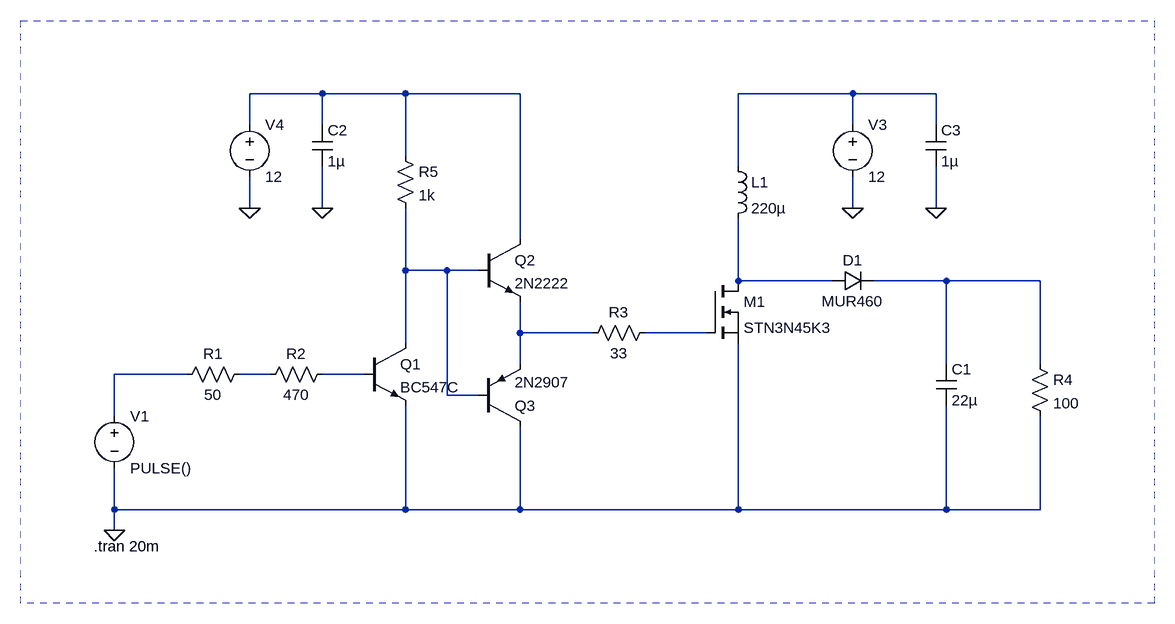
[diagram p0: schematic boost1.asc]
boost1.asc, the LTspice schematic file:
Version 4
SHEET 1 1556 680
WIRE 272 -128 160 -128
WIRE 400 -128 272 -128
WIRE 576 -128 400 -128
WIRE 1088 -128 912 -128
WIRE 1216 -128 1088 -128
WIRE 160 -80 160 -128
WIRE 272 -80 272 -128
WIRE 1088 -80 1088 -128
WIRE 1216 -80 1216 -128
WIRE 400 -32 400 -128
WIRE 912 -16 912 -128
WIRE 160 48 160 0
WIRE 272 48 272 -16
WIRE 1088 48 1088 0
WIRE 1216 48 1216 -16
WIRE 576 96 576 -128
WIRE 400 144 400 48
WIRE 464 144 400 144
WIRE 512 144 464 144
WIRE 912 160 912 64
WIRE 1056 160 912 160
WIRE 1232 160 1120 160
WIRE 1376 160 1232 160
WIRE 576 240 576 192
WIRE 688 240 576 240
WIRE 864 240 768 240
WIRE 400 256 400 144
WIRE 576 288 576 240
WIRE 1232 288 1232 160
WIRE 1376 288 1376 160
WIRE 64 304 -48 304
WIRE 192 304 144 304
WIRE 336 304 272 304
WIRE 464 336 464 144
WIRE 512 336 464 336
WIRE -48 368 -48 304
WIRE -48 512 -48 448
WIRE 400 512 400 352
WIRE 400 512 -48 512
WIRE 576 512 576 384
WIRE 576 512 400 512
WIRE 912 512 912 256
WIRE 912 512 576 512
WIRE 1232 512 1232 352
WIRE 1232 512 912 512
WIRE 1376 512 1376 368
WIRE 1376 512 1232 512
WIRE -48 544 -48 512
FLAG -48 544 0
FLAG 272 48 0
FLAG 1216 48 0
FLAG 1088 48 0
FLAG 160 48 0
SYMBOL res 160 288 R90
WINDOW 0 0 56 VBottom 2
WINDOW 3 32 56 VTop 2
SYMATTR InstName R1
SYMATTR Value 50
SYMBOL res 288 288 R90
WINDOW 0 0 56 VBottom 2
WINDOW 3 32 56 VTop 2
SYMATTR InstName R2
SYMATTR Value 470
SYMBOL npn 336 256 R0
SYMATTR InstName Q1
SYMATTR Value BC547C
SYMBOL npn 512 96 R0
SYMATTR InstName Q2
SYMATTR Value 2N2222
SYMBOL pnp 512 384 M180
SYMATTR InstName Q3
SYMATTR Value 2N2907
SYMBOL res 784 224 R90
WINDOW 0 0 56 VBottom 2
WINDOW 3 32 56 VTop 2
SYMATTR InstName R3
SYMATTR Value 33
SYMBOL res 1360 272 R0
SYMATTR InstName R4
SYMATTR Value 100
SYMBOL cap 1216 288 R0
SYMATTR InstName C1
SYMATTR Value 22µ
SYMBOL diode 1056 176 R270
WINDOW 0 32 32 VTop 2
WINDOW 3 0 32 VBottom 2
SYMATTR InstName D1
SYMATTR Value MUR460
SYMBOL ind 896 -32 R0
SYMATTR InstName L1
SYMATTR Value 220µ
SYMBOL nmos 864 160 R0
SYMATTR InstName M1
SYMATTR Value STN3N45K3
SYMBOL res 384 -48 R0
SYMATTR InstName R5
SYMATTR Value 1k
SYMBOL cap 256 -80 R0
SYMATTR InstName C2
SYMATTR Value 1µ
SYMBOL cap 1200 -80 R0
SYMATTR InstName C3
SYMATTR Value 1µ
SYMBOL voltage -48 352 R0
WINDOW 123 0 0 Left 0
WINDOW 39 0 0 Left 0
SYMATTR InstName V1
SYMATTR Value PULSE()
SYMBOL voltage 1088 -96 R0
WINDOW 123 0 0 Left 0
WINDOW 39 0 0 Left 0
SYMATTR InstName V3
SYMATTR Value 12
SYMBOL voltage 160 -96 R0
WINDOW 123 0 0 Left 0
WINDOW 39 0 0 Left 0
SYMATTR InstName V4
SYMATTR Value 12
TEXT -80 568 Left 2 !.tran 20m
RECTANGLE Normal 1552 656 -192 -240 2

The netlist it stands for:
* boost1.asc
R1 N009 N008 50
R2 N010 N009 470
Q1 N003 N010 0 0 BC547C
Q2 N001 N003 N006 0 2N2222
Q3 0 N003 N006 0 2N2907
R3 N007 N006 33
R4 N005 0 100
C1 N005 0 22µ
D1 N004 N005 MUR460
L1 N002 N004 220µ
M1 N004 N007 0 0 STN3N45K3
R5 N001 N003 1k
C2 N001 0 1µ
C3 N002 0 1µ
V1 N008 0 PULSE()
V3 N002 0 12
V4 N001 0 12
.model D D
.lib standard.dio
.model NPN NPN
.model PNP PNP
.lib standard.bjt
.model NMOS NMOS
.model PMOS PMOS
.lib standard.mos
.tran 20m
.backanno
.end